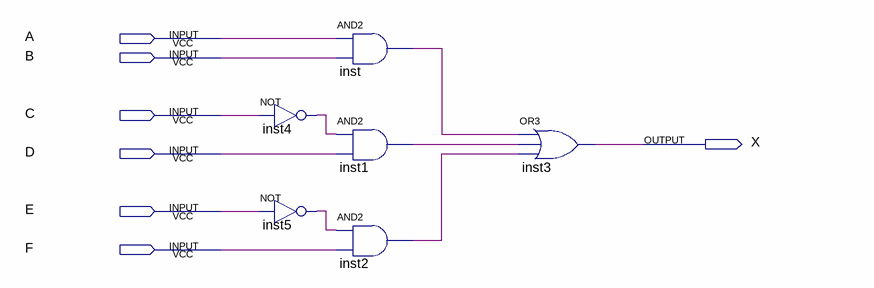
[diagram p0: schematic sheet]
// Quartus schematic twelve.bdf as structural Verilog: 6 symbols, 7 pins
module twelve (
  input  A,
  input  B,
  input  C,
  input  D,
  input  E,
  input  F,
  output X
);

  wire inst1_out, inst2_out, inst4_out, inst5_out, inst_out;

  not inst4 (inst4_out, C);
  not inst5 (inst5_out, E);
  and inst (inst_out, A, B);
  and inst1 (inst1_out, inst4_out, D);
  and inst2 (inst2_out, inst5_out, F);
  or inst3 (X, inst_out, inst1_out, inst2_out);
endmodule
